# EAGLE design version 2.0 (EAGLE 9.6.2)
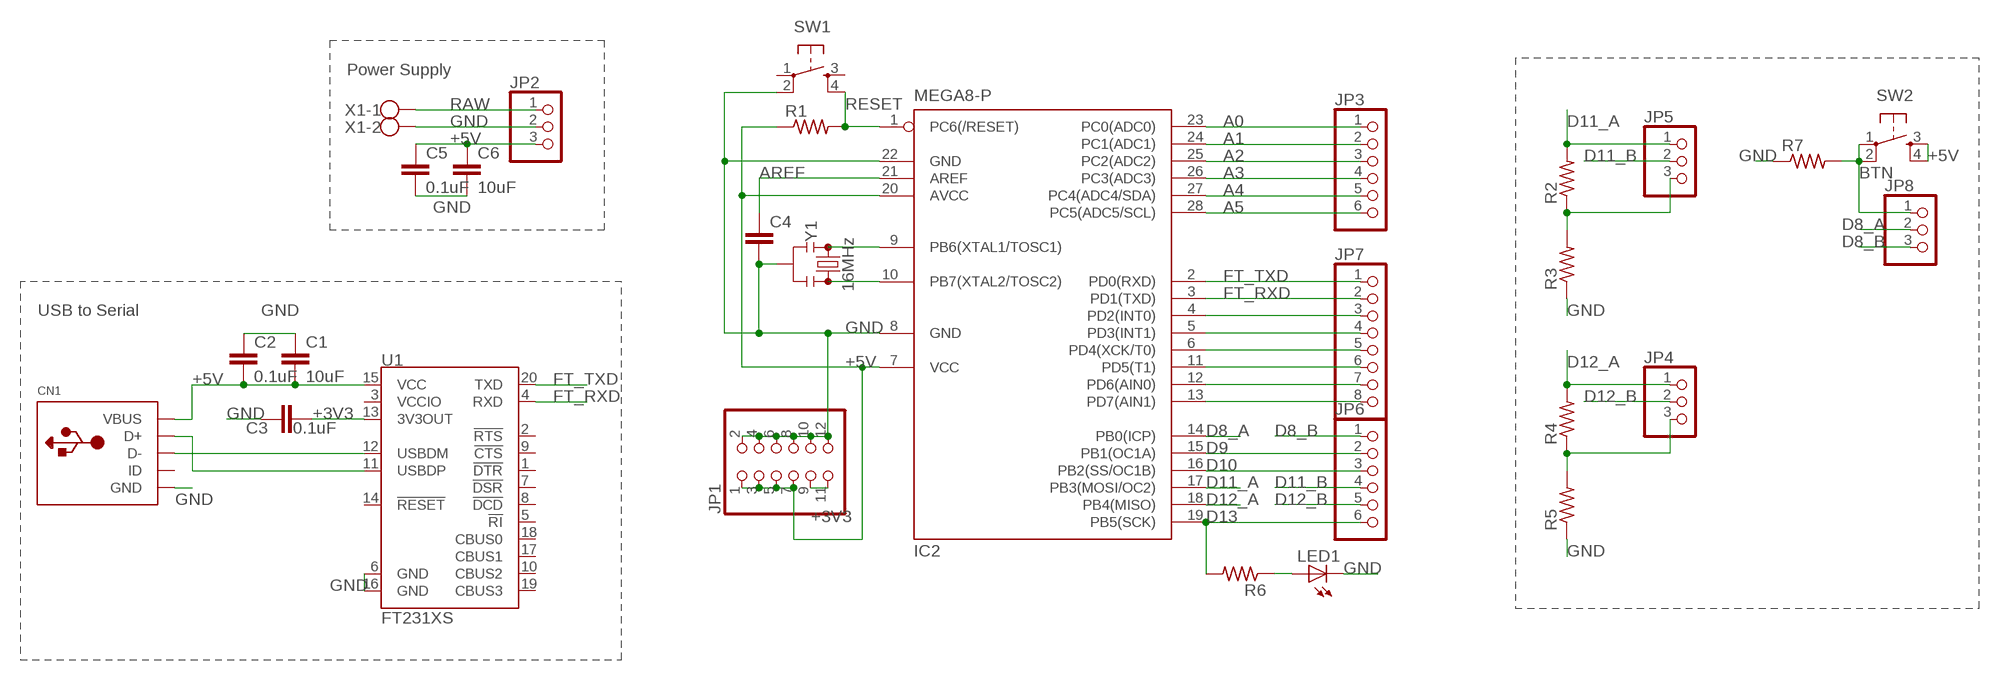
[diagram p0: schematic, sheet 1]

## Parts
C1  10uF  C-EUC0603  [C0603]
C2  0.1uF  C-EUC0603  [C0603]
C3  0.1uF  C-EUC0603  [C0603]
C4  C-EUC0603  [C0603]
C5  0.1uF  C-EUC0603  [C0603]
C6  10uF  C-EUC0603  [C0603]
CN1  USBMINIB  [USB-MINIB]
IC2  MEGA8-P  [DIL28-3]
JP1  PINHD-2X6  [2X06]
JP2  PINHD-1X3  [1X03]
JP3  PINHD-1X6  [1X06]
JP4  PINHD-1X3  [1X03]
JP5  PINHD-1X3  [1X03]
JP6  PINHD-1X6  [1X06]
JP7  PINHD-1X8  [1X08]
JP8  PINHD-1X3  [1X03]
LED1  LEDCHIP-LED0805  [CHIP-LED0805]
R1  R-US_R0603  [R0603]
R2  R-US_R0603  [R0603]
R3  R-US_R0603  [R0603]
R4  R-US_R0603  [R0603]
R5  R-US_R0603  [R0603]
R6  R-US_R0603  [R0603]
R7  R-US_R0603  [R0603]
SW1  SWITCH_SPST_4_PINRECT  [TACTILE_SWITCH_SMD_4.6X2.8MM]
SW2  SWITCH_SPST_4_PINRECT  [TACTILE_SWITCH_SMD_4.6X2.8MM]
U1  FT231XS  [SSOP20_L]
X1  W237-102  [W237-102]
Y1  16MHz  RESONATOR-16MHZSMD_3.2X1.3  [RESONATOR-SMD-3.2X1.3]

## Nets
+3V3: C3.2 JP1.9 JP1.11 U1.13(3V3OUT)
+5V: C1.2 C2.2 C5.1 C6.1 CN1.VBUS IC2.7(VCC) IC2.20(AVCC) JP1.1 JP1.3 JP1.5 JP1.7 JP2.3 R1.1 SW2.3 SW2.4 U1.15(VCC)
A0: IC2.23(PC0(ADC0)) JP3.1
A1: IC2.24(PC1(ADC1)) JP3.2
A2: IC2.25(PC2(ADC2)) JP3.3
A3: IC2.26(PC3(ADC3)) JP3.4
A4: IC2.27(PC4(ADC4/SDA)) JP3.5
A5: IC2.28(PC5(ADC5/SCL)) JP3.6
AREF: C4.1 IC2.21(AREF)
BTN: JP8.1 R7.2 SW2.1 SW2.2
D8_A: IC2.14(PB0(ICP)) JP8.2
D8_B: JP6.1 JP8.3
D9: IC2.15(PB1(OC1A)) JP6.2
D10: IC2.16(PB2(SS/OC1B)) JP6.3
D11_A: IC2.17(PB3(MOSI/OC2)) JP5.1 R2.2
D11_B: JP5.2 JP6.4
D12_A: IC2.18(PB4(MISO)) JP4.1 R4.2
D12_B: JP4.2 JP6.5
D13: IC2.19(PB5(SCK)) JP6.6 R6.2
FT_RXD: IC2.3(PD1(TXD)) JP7.2 U1.4(RXD)
FT_TXD: IC2.2(PD0(RXD)) JP7.1 U1.20(TXD)
GND: C1.1 C2.1 C3.1 C4.2 C5.2 C6.2 CN1.GND IC2.8(GND) IC2.22(GND) JP1.2 JP1.4 JP1.6 JP1.8 JP1.10 JP1.12 JP2.2 LED1.C R3.1 R5.1 R7.1 SW1.2 U1.6(GND) U1.16(GND) X1.2 Y1.2
N$1: CN1.D- U1.12(USBDM)
N$2: CN1.D+ U1.11(USBDP)
N$4: LED1.A R6.1
N$5: IC2.9(PB6(XTAL1/TOSC1)) Y1.1
N$6: IC2.10(PB7(XTAL2/TOSC2)) Y1.3
N$8: JP5.3 R2.1 R3.2
N$12: JP4.3 R4.1 R5.2
N$13: IC2.4(PD2(INT0)) JP7.3
N$14: IC2.5(PD3(INT1)) JP7.4
N$15: IC2.6(PD4(XCK/T0)) JP7.5
N$16: IC2.11(PD5(T1)) JP7.6
N$17: IC2.12(PD6(AIN0)) JP7.7
N$18: IC2.13(PD7(AIN1)) JP7.8
RAW: JP2.1 X1.1
RESET: IC2.1(PC6(/RESET)) R1.2 SW1.4
Unconnected: CN1.ID SW1.1 SW1.3 U1.1(!DTR) U1.2(!RTS) U1.3(VCCIO) U1.5(!RI) U1.7(!DSR) U1.8(!DCD) U1.9(!CTS) U1.10(CBUS2) U1.14(!RESET) U1.17(CBUS1) U1.18(CBUS0) U1.19(CBUS3)

## Notes on the sheet
- Power Supply
- USB to Serial

## Library data of the parts
C1-C6 = rcl:C-EU: CAPACITOR, European symbol; SPICEPREFIX: C
CN1 = adafruit:USB: USB Connectors USBMINIB - Surface Mount Female Mini-B USB Connector 4UConnector: 06564 By microbuilder.eu Thru-hole RA Female Mini-B USB Connector 4UConnector: 18732 By ladyada.net
IC2 = atmel:MEGA8-P: MICROCONTROLLER 8 Kbytes FLASH, 1 kbytes SRAM, 512 bytes EEPROM, USART, 4-channel 10 bit ADC, 2-channel 8 bit ADC Pin compatible with Atmega48, ATMega88, ATMega168 Source: avr.lbr; OC_FARNELL: unknown; OC_NEWARK: unknown
JP1 = pinhead:PINHD-2X6: PIN HEADER
JP2 JP4 JP5 JP8 = pinhead:PINHD-1X3: PIN HEADER
JP3 JP6 = pinhead:PINHD-1X6: PIN HEADER
JP7 = pinhead:PINHD-1X8: PIN HEADER
LED1 = adafruit:LED: LED OSRAM: - CHIPLED LG R971, LG N971, LY N971, LG Q971, LY Q971, LO R971, LY R971 LH N974, LH R974 LS Q976, LO Q976, LY Q976 LO Q996 - Hyper CHIPLED LW Q18S LB Q993, LB Q99A, LB R99A - SideLED LS A670, LO A670, LY A670, LG A670, LP A670 LB A673, LV A673, LT A673, LW A673 LH A674 LY A675 LS A676, LA A676, LO A676, LY A676, LW A676 LS A679, LY A679, LG A679 - Hyper Micro SIDELED® LS Y876, LA Y876, LO Y876, LY Y876 LT Y87S - SmartLED LW L88C, LW L88S LB L89C, LB L89S, LG L890 LS L89K, LO L89K, LY L89K LS L896, LA L896, LO L896, LY L896 - TOPLED LS T670, LO T670, LY T670, LG T670, LP T670 LSG T670, LSP T670, LSY T670, LOP T670, LYG T670 LG T671, LOG T671, LSG T671 LB T673, LV T673, LT T673, LW T673 LH T674 LS T676, LA T676, LO T676, LY T676, LB T676, LH T676, LSB T676, LW T676 LB T67C, LV T67C, LT T67C, LS T67K, LO T67K, LY T67K, LW E67C LS E67B, LA E67B, LO E67B, LY E67B, LB E67C, LV E67C, LT E67C LW T67C LS T679, LY T679, LG T679 LS T770, LO T770, LY T770, LG T770, LP T770 LB T773, LV T773, LT T773, LW T773 LH T774 LS E675, LA E675, LY E675, LS T675 LS T776, LA T776, LO T776, LY T776, LB T776 LHGB T686 LT T68C, LB T68C - Hyper Mini TOPLED® LB M676 - Mini TOPLED Santana® LG M470 LS M47K, LO M47K, LY M47K Source: http://www.osram.convergy.de/
R1-R7 = rcl:R-US_: RESISTOR, American symbol; SPICEPREFIX: R
SW1 SW2 = a_personal:SWITCH_SPST_4_PIN; PROD_ID: SWCH-13065
U1 = a_personal:FT231X: FTDI FT231X Full Speed USB to Full-handshake UART This USB2.0 Full Speed IC offers a compact bridge to full handshake UART interfaces. The device is a UART, capable of operating up to 3MBaud, with low power consumption (8mA). The FT231X includes the complete FT-X series feature set and enables USB to be added into a system design quickly and easily over a UART interface.; PROD_ID: IC-11524
X1 = con-wago-500:W237-102: WAGO SCREW CLAMP; MPN: 237-102; OC_FARNELL: unknown; OC_NEWARK: 70K9898
Y1 = a_personal:RESONATOR-16MHZ: 16MHz Resonator Digikey Example <http://www.digikey.com/product-detail/en/murata-electronics-north-america/CSTCE16M0V53-R0/490-1198-1-ND/584635> Frequency: 16MHz Frequency Stability: ±0.3% Frequency Tolerance: ±0.5% Capacitance: 15pF; PROD_ID: XTAL-08900

## Board
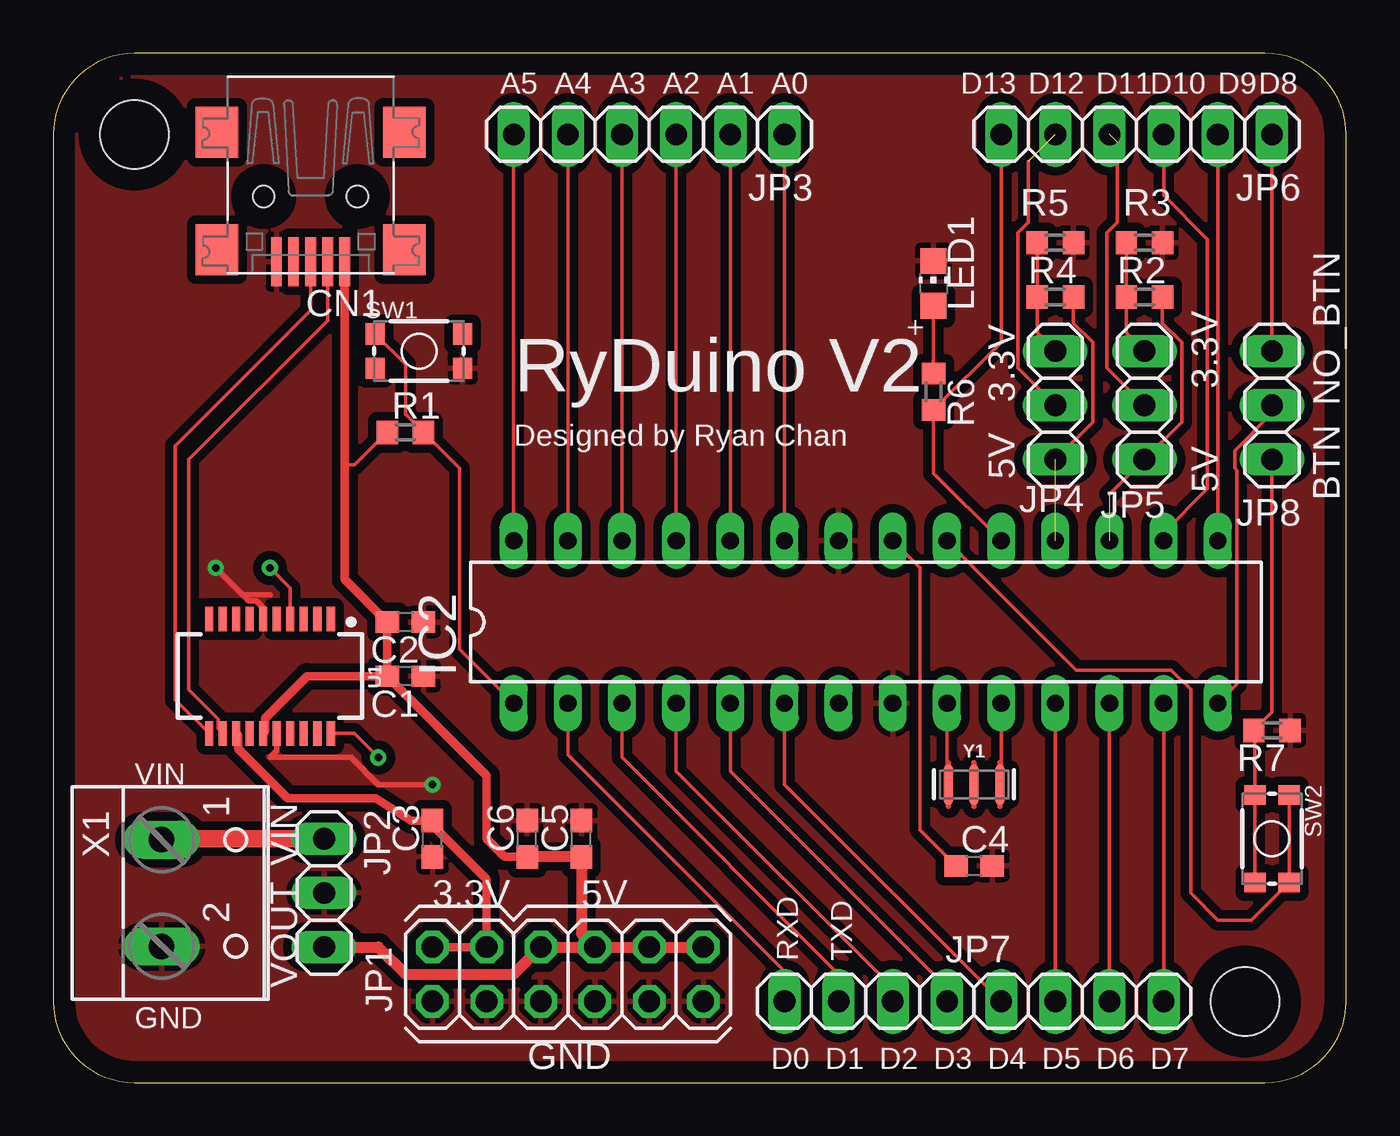
[diagram p1: board, top side]
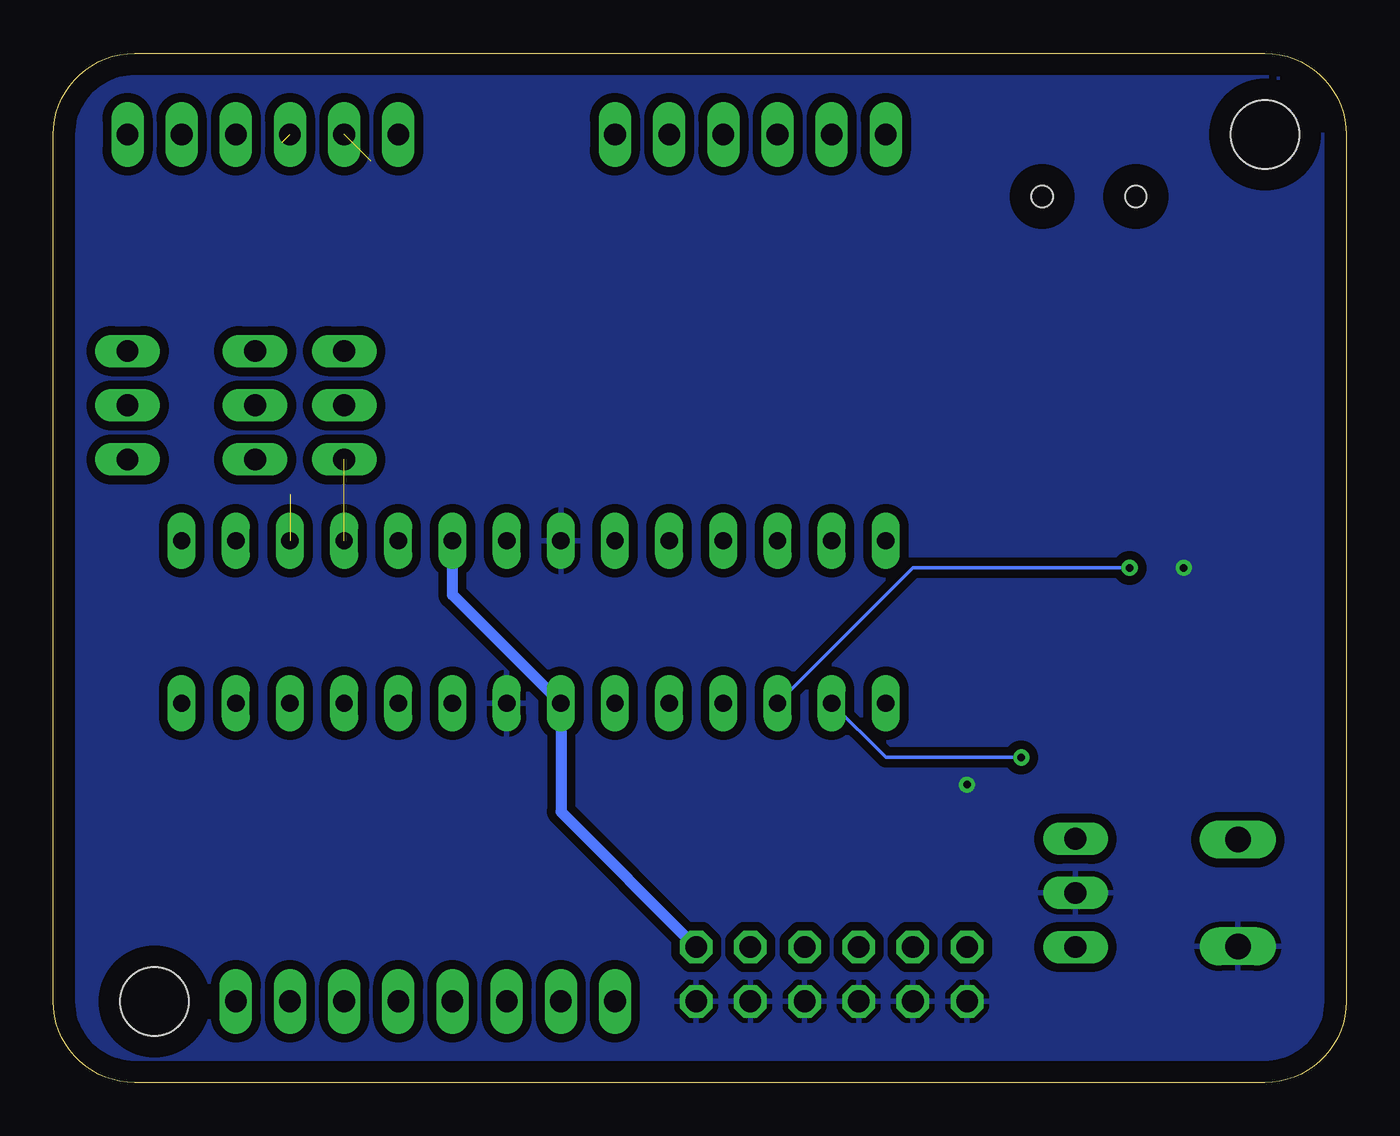
[diagram p2: board, bottom side, seen from below]

Size 60.63 x 48.25 mm. Coordinates in mm from the lower left corner, seen from the top.
Outline: 0,44.44 0,3.81 arc90 3.81,0 56.82,0 arc90 60.63,3.81 60.63,44.44 arc90 56.82,48.25 3.81,48.25 arc90 0,44.44
Copper layers (1*16): Top 0.035mm / dielectric 1.5mm / Bottom 0.035mm
Design rules "default": minimum track width 6mil, minimum drill 0.35mm, track to track 6mil, track to pad 6mil, pad to pad 6mil, via to via 6mil, smd to smd 6mil, copper to edge 40mil, drill to drill 6mil, minimum pad ring 10mil, minimum via ring 8mil, stop-mask expansion 4mil, vias tented up to drill 0mil, thermal gap 10mil
Holes 3.2 mm at 3.81,44.45 55.88,3.81

### Footprints (pad centres in the part's own frame; a part is rotated, then mirrored left to right if it is on the bottom)
C0603 = smd 1.1 x 1: 1 -0.85,0; 2 0.85,0
USB-MINIB = smd 0.5 x 2.308: D+ 0,4.064; D- -0.8,4.064; GND 1.6,4.064; ID 0.8,4.064; VBUS -1.6,4.064 | smd 2 x 2.4: GND1 -4.4,-2; GND2 -4.4,3.5; GND3 4.4,3.5; GND4 4.4,-2 | hole 1: -2.2,1; 2.2,1
DIL28-3 = drill 0.813 long: 1 -16.51,-3.81; 2 -13.97,-3.81; 3 -11.43,-3.81; 4 -8.89,-3.81; 5 -6.35,-3.81; 6 -3.81,-3.81; 7 -1.27,-3.81; 8 1.27,-3.81; 9 3.81,-3.81; 10 6.35,-3.81; 11 8.89,-3.81; 12 11.43,-3.81; 13 13.97,-3.81; 14 16.51,-3.81; 15 16.51,3.81; 16 13.97,3.81; 17 11.43,3.81; 18 8.89,3.81; 19 6.35,3.81; 20 3.81,3.81; 21 1.27,3.81; 22 -1.27,3.81; 23 -3.81,3.81; 24 -6.35,3.81; 25 -8.89,3.81; 26 -11.43,3.81; 27 -13.97,3.81; 28 -16.51,3.81
2X06 = drill 1.016 octagon: 1 -6.35,-1.27; 2 -6.35,1.27; 3 -3.81,-1.27; 4 -3.81,1.27; 5 -1.27,-1.27; 6 -1.27,1.27; 7 1.27,-1.27; 8 1.27,1.27; 9 3.81,-1.27; 10 3.81,1.27; 11 6.35,-1.27; 12 6.35,1.27
1X03 = drill 1.016 long: 1 -2.54,0; 2 0,0; 3 2.54,0
1X06 = drill 1.016 long: 1 -6.35,0; 2 -3.81,0; 3 -1.27,0; 4 1.27,0; 5 3.81,0; 6 6.35,0
1X08 = drill 1.016 long: 1 -8.89,0; 2 -6.35,0; 3 -3.81,0; 4 -1.27,0; 5 1.27,0; 6 3.81,0; 7 6.35,0; 8 8.89,0
CHIP-LED0805 = smd 1.2 x 1.2: A 0,-1.05; C 0,1.05
R0603 = smd 1 x 1.1: 1 -0.85,0; 2 0.85,0
TACTILE_SWITCH_SMD_4.6X2.8MM = smd 0.9 x 1: 1 -2.05,-0.8; 2 2.05,-0.8; 3 2.05,0.8; 4 -2.05,0.8
SSOP20_L = smd 0.381 x 1.143: 1 -2.857,-2.68; 2 -2.223,-2.68; 3 -1.587,-2.68; 4 -0.953,-2.68; 5 -0.318,-2.68; 6 0.318,-2.68; 7 0.953,-2.68; 8 1.587,-2.68; 9 2.223,-2.68; 10 2.857,-2.68; 11 2.857,2.68; 12 2.223,2.68; 13 1.587,2.68; 14 0.953,2.68; 15 0.318,2.68; 16 -0.318,2.68; 17 -0.953,2.68; 18 -1.587,2.68; 19 -2.223,2.68; 20 -2.857,2.68
W237-102 = drill 1.194 long: 1 -2.5,-1.27; 2 2.5,-1.27
RESONATOR-SMD-3.2X1.3 = smd 0.45 x 1.905: 1 -1.2,0; 2 0,0; 3 1.2,0

### Placement (x,y rotation side)
C1  16.51,19.05 180 top
C2  16.51,21.59 180 top
C3  17.78,11.43 90 top
C4  43.18,10.16 0 top
C5  24.77,11.43 90 top
C6  22.22,11.43 90 top
CN1  12.06,42.55 180 top
IC2  38.1,21.59 0 top
JP1  24.13,5.08 180 top
JP2  12.7,8.89 270 top
JP3  27.94,44.45 180 top
JP4  46.99,31.75 90 top
JP5  51.17,31.75 90 top
JP6  50.8,44.45 180 top
JP7  43.18,3.81 0 top
JP8  57.15,31.75 90 top
LED1  41.27,37.47 0 top
R1  16.51,30.48 0 top
R2  51.17,36.83 0 top
R3  51.17,39.37 180 top
R4  46.99,36.83 0 top
R5  46.99,39.37 180 top
R6  41.27,32.38 270 top
R7  57.15,16.51 180 top
SW1  17.14,34.29 0 top
SW2  57.15,11.43 270 top
U1  10.16,19.05 180 top
X1  6.35,8.89 270 top
Y1  43.18,13.97 0 top

### Tracks (layer width: path | path; a pad name or v marks a point on that pad's centre or on a via)
+3V3
  Top 0.406: U1.13 8.66,16.28 8.66,15.65 10.98,13.34 15.12,13.34 16.78,12.28 C3.2 17.78,12.06 20.32,9.53 JP1.9 JP1.11
+5V
  Top 0.152: IC2.20 47.98,19.33 52.44,19.33 53.34,18.43 53.34,8.89 54.61,7.62 56.19,7.62 SW2.3 SW2.4 | R1.1 14.14,28.96 13.66,28.96
  Top 0.406: U1.15 9.93,16.46 9.93,17.09 11.89,19.05 C1.2 | C1.2 C2.2 13.66,23.59 13.66,28.96 CN1.VBUS | C1.2 20.32,14.39 20.32,11.43 21.17,10.58 C6.1
  Top 0.508: C6.1 C5.1 24.77,6.99 JP1.5 | JP2.3 15.24,6.35 16.51,5.08 21.59,5.08 JP1.7 JP1.5 | JP1.5 JP1.1 JP1.3
  Bottom 0.508: IC2.20 41.91,22.86 IC2.7 36.83,12.7 JP1.1
A0
  Top 0.152: IC2.23 JP3.1
A1
  Top 0.152: IC2.24 JP3.2
A2
  Top 0.152: IC2.25 JP3.3
A3
  Top 0.152: IC2.26 JP3.4
A4
  Top 0.152: IC2.27 JP3.5
A5
  Top 0.152: IC2.28 JP3.6
AREF
  Top 0.152: C4.1 40.64,11.85 40.64,24.13 IC2.21
BTN
  Top 0.152: JP8.1 57.15,17.36 R7.2 56.35,16.46 SW2.1 SW2.2
D8_A
  Top 0.152: JP8.2 57.15,31.37 55.4,29.62 55.4,28.8 55.5,28.7 55.5,18.67 IC2.14
D8_B
  Top 0.152: JP6.1 JP8.3
D9
  Top 0.152: JP6.2 IC2.15
D10
  Top 0.152: IC2.16 52.07,25.78 54.13,27.83 54.13,39.54 52.07,41.59 JP6.3
D11_A  (1 unrouted)
  Top 0.152: R2.2 52.02,35.6 52.92,34.7 52.92,30.96 JP5.1 49.53,27.57
D11_B  (1 unrouted)
  Top 0.152: 49.9,44.08 49.9,40.32 49.41,39.84 49.41,33.5 JP5.2
D12_A  (1 unrouted)
  Top 0.152: R4.2 47.84,35.6 48.74,34.7 48.74,30.96 JP4.1
D12_B  (1 unrouted)
  Top 0.152: JP4.2 45.24,33.5 45.24,39.84 45.72,40.32 45.72,43.18
D13
  Top 0.152: IC2.19 41.27,28.57 R6.2 44.45,34.71 JP6.6
FT_RXD  (via drill 0.35)
  Top 0.152: JP7.2 36.83,5.08 26.67,15.24 IC2.3 | U1.4 11.11,23.18 v10.16,24.13
  Bottom 0.152: v10.16,24.13 20.32,24.13 IC2.3
FT_TXD  (via drill 0.35)
  Top 0.152: JP7.1 34.29,5.21 24.13,15.37 IC2.2 | U1.20 14.11,16.37 v15.24,15.24
  Bottom 0.152: v15.24,15.24 21.59,15.24 IC2.2
GND  (via drill 0.35)
  Top 0.254: v7.62,24.13 8.89,22.86 | 8.89,22.86 10.16,22.86 | 8.89,22.86 9.17,22.58 9.51,22.58 9.84,22.25 U1.6 | U1.16 10.48,15.56 10.16,15.24 13.97,15.24 15.24,13.97 v17.78,13.97
  pour Top (isolate 0.406): 0,3.81 0,45.72 2.54,48.26 58.42,48.26 60.96,45.72 60.96,2.54 58.42,0 2.54,0 0,2.54
  pour Bottom (isolate 0.406): 0,2.54 0,45.72 2.54,48.26 58.42,48.26 60.96,45.72 60.96,2.54 58.42,0 2.54,0
N$1
  Top 0.152: CN1.D- 12.86,35.73 6.35,29.21 6.35,18.41 7.72,17.04 7.72,16.59 U1.12
N$2
  Top 0.152: CN1.D+ 12.06,36.2 5.71,29.84 5.71,17.96 U1.11
N$4
  Top 0.152: LED1.A R6.1
N$5
  Top 0.152: IC2.9 41.91,14.04 Y1.1
N$6
  Top 0.152: IC2.10 44.45,14.04 Y1.3
N$8
  Top 0.152: JP5.3 50.32,35.14 R2.1 R3.2
N$12
  Top 0.152: R5.2 R4.1 46.14,35.14 JP4.3
N$13
  Top 0.152: JP7.3 39.37,4.45 29.21,14.61 IC2.4
N$14
  Top 0.152: JP7.4 41.91,4.45 31.75,14.61 IC2.5
N$15
  Top 0.152: JP7.5 34.29,13.97 IC2.6
N$16
  Top 0.152: IC2.11 JP7.6
N$17
  Top 0.152: IC2.12 JP7.7
N$18
  Top 0.152: IC2.13 JP7.8
RAW
  Top 0.813: X1.1 5.12,11.43 JP2.1
RESET
  Top 0.152: IC2.1 19.05,20.32 19.05,28.79 R1.2 16.51,31.33 16.51,33.67 SW1.4

### Text on the board
tPlace: A5 | A4 | A3 | A2 | A1 | A0 | D13 | D12 | D11 | D10 | D9 | D8 | 3.3V | 3.3V | RyDuino V2 | NO_BTN | Designed by Ryan Chan | 5V | 5V | BTN | VIN | VIN | 3.3V | 5V | RXD | TXD | VOUT | GND | GND | D0 | D1 | D2 | D3 | D4 | D5 | D6 | D7